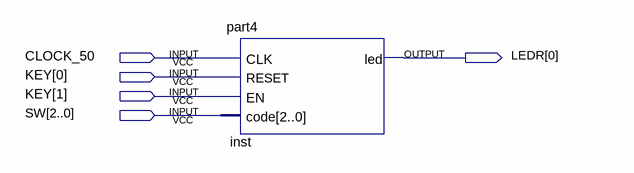
[diagram p0: schematic sheet]
// Quartus schematic part4_sch.bdf as structural Verilog: 1 symbols, 5 pins
module part4_sch (
  input  CLOCK_50,
  input  [1:0] KEY,
  input  [2:0] SW,
  output [0:0] LEDR
);

  part4 inst (.CLK(CLOCK_50), .RESET(KEY[0]), .EN(KEY[1]), .code(SW), .led(LEDR[0]));
endmodule
